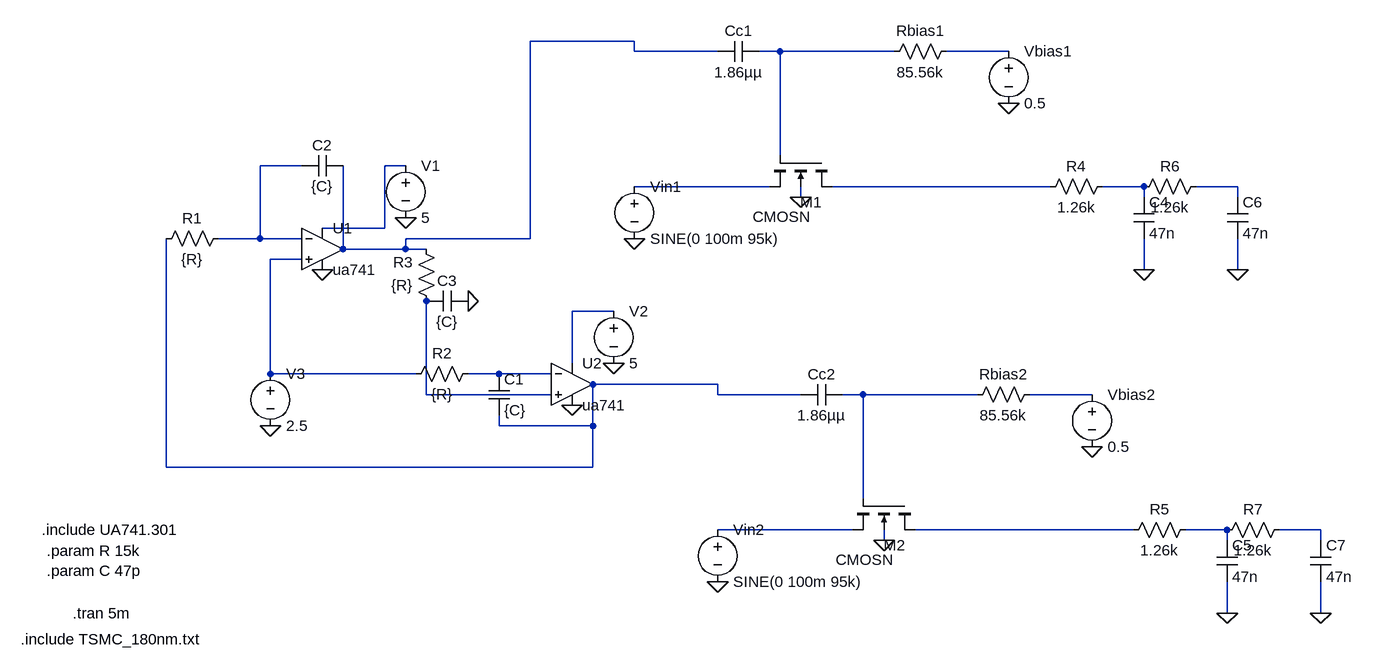
[diagram p0: schematic quad_oscillator.asc]
quad_oscillator.asc, the LTspice schematic file:
Version 4
SHEET 1 1912 856
WIRE 800 -80 640 -80
WIRE 800 -64 800 -80
WIRE 928 -64 800 -64
WIRE 1024 -64 992 -64
WIRE 1200 -64 1024 -64
WIRE 1376 -64 1280 -64
WIRE 1024 96 1024 -64
WIRE 288 112 224 112
WIRE 448 112 416 112
WIRE 1008 144 800 144
WIRE 1440 144 1104 144
WIRE 1584 144 1520 144
WIRE 1728 144 1664 144
WIRE 1056 160 1056 144
WIRE 1584 160 1584 144
WIRE 1728 160 1728 144
WIRE 416 208 416 112
WIRE 416 208 320 208
WIRE 224 224 224 112
WIRE 224 224 160 224
WIRE 288 224 224 224
WIRE 640 224 640 -80
WIRE 640 224 448 224
WIRE 352 240 352 112
WIRE 448 240 448 224
WIRE 448 240 352 240
WIRE 480 240 448 240
WIRE 288 256 240 256
WIRE 1584 272 1584 224
WIRE 1728 272 1728 224
WIRE 768 336 704 336
WIRE 704 416 704 336
WIRE 240 432 240 256
WIRE 464 432 240 432
WIRE 592 432 544 432
WIRE 672 432 592 432
WIRE 928 448 736 448
WIRE 480 464 480 320
WIRE 672 464 480 464
WIRE 928 464 928 448
WIRE 1056 464 928 464
WIRE 1152 464 1120 464
WIRE 1328 464 1152 464
WIRE 1504 464 1408 464
WIRE 592 512 592 496
WIRE 736 512 736 448
WIRE 736 512 592 512
WIRE 80 576 80 224
WIRE 736 576 736 512
WIRE 736 576 80 576
WIRE 1152 624 1152 464
WIRE 1136 672 928 672
WIRE 1568 672 1232 672
WIRE 1712 672 1648 672
WIRE 1856 672 1792 672
WIRE 1184 688 1184 672
WIRE 1712 688 1712 672
WIRE 1856 688 1856 672
WIRE 1712 800 1712 752
WIRE 1856 800 1856 752
FLAG 544 320 0
FLAG 320 272 0
FLAG 704 480 0
FLAG 768 416 0
FLAG 448 192 0
FLAG 240 512 0
FLAG 1376 16 0
FLAG 800 224 0
FLAG 1056 160 0
FLAG 1584 272 0
FLAG 1504 544 0
FLAG 928 752 0
FLAG 1184 688 0
FLAG 1712 800 0
FLAG 1728 272 0
FLAG 1856 800 0
SYMBOL OpAmps/opamp2 320 176 R0
SYMATTR InstName U1
SYMATTR Value ua741
SYMBOL res 176 208 R90
WINDOW 0 0 56 VBottom 2
WINDOW 3 32 56 VTop 2
SYMATTR InstName R1
SYMATTR Value {R}
SYMBOL res 560 416 R90
WINDOW 0 0 56 VBottom 2
WINDOW 3 32 56 VTop 2
SYMATTR InstName R2
SYMATTR Value {R}
SYMBOL res 496 336 R180
WINDOW 0 36 76 Left 2
WINDOW 3 36 40 Left 2
SYMATTR InstName R3
SYMATTR Value {R}
SYMBOL OpAmps/opamp2 704 384 R0
SYMATTR InstName U2
SYMATTR Value ua741
SYMBOL cap 576 432 R0
SYMATTR InstName C1
SYMATTR Value {C}
SYMBOL cap 352 96 R90
WINDOW 0 0 32 VBottom 2
WINDOW 3 32 32 VTop 2
SYMATTR InstName C2
SYMATTR Value {C}
SYMBOL cap 544 304 R90
WINDOW 0 0 32 VBottom 2
WINDOW 3 32 32 VTop 2
SYMATTR InstName C3
SYMATTR Value {C}
SYMBOL voltage 448 96 R0
SYMATTR InstName V1
SYMATTR Value 5
SYMBOL voltage 768 320 R0
SYMATTR InstName V2
SYMATTR Value 5
SYMBOL voltage 240 416 R0
SYMATTR InstName V3
SYMATTR Value 2.5
SYMBOL nmos4 1104 96 R90
WINDOW 0 72 15 VRight 2
WINDOW 3 94 33 VRight 2
SYMATTR InstName M1
SYMATTR Value CMOSN
SYMATTR Value2 l=1u w=3u ad=7.5uu as=7.5uu pd=11u ps=11u
SYMBOL voltage 800 128 R0
SYMATTR InstName Vin1
SYMATTR Value SINE(0 100m 95k)
SYMBOL voltage 1376 -80 R0
SYMATTR InstName Vbias1
SYMATTR Value 0.5
SYMBOL cap 992 -80 R90
WINDOW 0 0 32 VBottom 2
WINDOW 3 32 32 VTop 2
SYMATTR InstName Cc1
SYMATTR Value 1.86µµ
SYMBOL res 1296 -80 R90
WINDOW 0 0 56 VBottom 2
WINDOW 3 32 56 VTop 2
SYMATTR InstName Rbias1
SYMATTR Value 85.56k
SYMBOL res 1536 128 R90
WINDOW 0 0 56 VBottom 2
WINDOW 3 32 56 VTop 2
SYMATTR InstName R4
SYMATTR Value 1.26k
SYMBOL cap 1568 160 R0
SYMATTR InstName C4
SYMATTR Value 47n
SYMBOL nmos4 1232 624 R90
WINDOW 0 72 15 VRight 2
WINDOW 3 94 33 VRight 2
SYMATTR InstName M2
SYMATTR Value CMOSN
SYMATTR Value2 l=1u w=3u ad=7.5uu as=7.5uu pd=11u ps=11u
SYMBOL voltage 928 656 R0
SYMATTR InstName Vin2
SYMATTR Value SINE(0 100m 95k)
SYMBOL voltage 1504 448 R0
SYMATTR InstName Vbias2
SYMATTR Value 0.5
SYMBOL cap 1120 448 R90
WINDOW 0 0 32 VBottom 2
WINDOW 3 32 32 VTop 2
SYMATTR InstName Cc2
SYMATTR Value 1.86µµ
SYMBOL res 1424 448 R90
WINDOW 0 0 56 VBottom 2
WINDOW 3 32 56 VTop 2
SYMATTR InstName Rbias2
SYMATTR Value 85.56k
SYMBOL res 1664 656 R90
WINDOW 0 0 56 VBottom 2
WINDOW 3 32 56 VTop 2
SYMATTR InstName R5
SYMATTR Value 1.26k
SYMBOL cap 1696 688 R0
SYMATTR InstName C5
SYMATTR Value 47n
SYMBOL res 1680 128 R90
WINDOW 0 0 56 VBottom 2
WINDOW 3 32 56 VTop 2
SYMATTR InstName R6
SYMATTR Value 1.26k
SYMBOL cap 1712 160 R0
SYMATTR InstName C6
SYMATTR Value 47n
SYMBOL res 1808 656 R90
WINDOW 0 0 56 VBottom 2
WINDOW 3 32 56 VTop 2
SYMATTR InstName R7
SYMATTR Value 1.26k
SYMBOL cap 1840 688 R0
SYMATTR InstName C7
SYMATTR Value 47n
TEXT -112 672 Left 2 !.include UA741.301
TEXT -64 800 Left 2 !.tran 5m
TEXT -104 704 Left 2 !.param R 15k\n.param C 47p
TEXT -144 840 Left 2 !.include TSMC_180nm.txt

The netlist it stands for:
* quad_oscillator.asc
XU1 N010 N004 N005 0 N001 ua741  ; pins In+ In- V+ V- OUT
R1 N004 N013 {R}
R2 N012 N010 {R}
R3 N014 N001 {R}
XU2 N014 N012 N011 0 N013 ua741  ; pins In+ In- V+ V- OUT
C1 N012 N013 {C}
C2 N001 N004 {C}
C3 0 N014 {C}
V1 N005 0 5
V2 N011 0 5
V3 N010 0 2.5
M1 N007 N002 N006 0 CMOSN l=1u w=3u ad=7.5uu as=7.5uu pd=11u ps=11u
Vin1 N006 0 SINE(0 100m 95k)
Vbias1 N003 0 0.5
Cc1 N002 N001 1.86µµ
Rbias1 N003 N002 85.56k
R4 N008 N007 1.26k
C4 N008 0 47n
M2 N018 N015 N017 0 CMOSN l=1u w=3u ad=7.5uu as=7.5uu pd=11u ps=11u
Vin2 N017 0 SINE(0 100m 95k)
Vbias2 N016 0 0.5
Cc2 N015 N013 1.86µµ
Rbias2 N016 N015 85.56k
R5 N019 N018 1.26k
C5 N019 0 47n
R6 N009 N008 1.26k
C6 N009 0 47n
R7 N020 N019 1.26k
C7 N020 0 47n
.model NMOS NMOS
.model PMOS PMOS
.lib standard.mos
.include UA741.301
.tran 5m
.param R 15k
.param C 47p
.include TSMC_180nm.txt
.backanno
.end